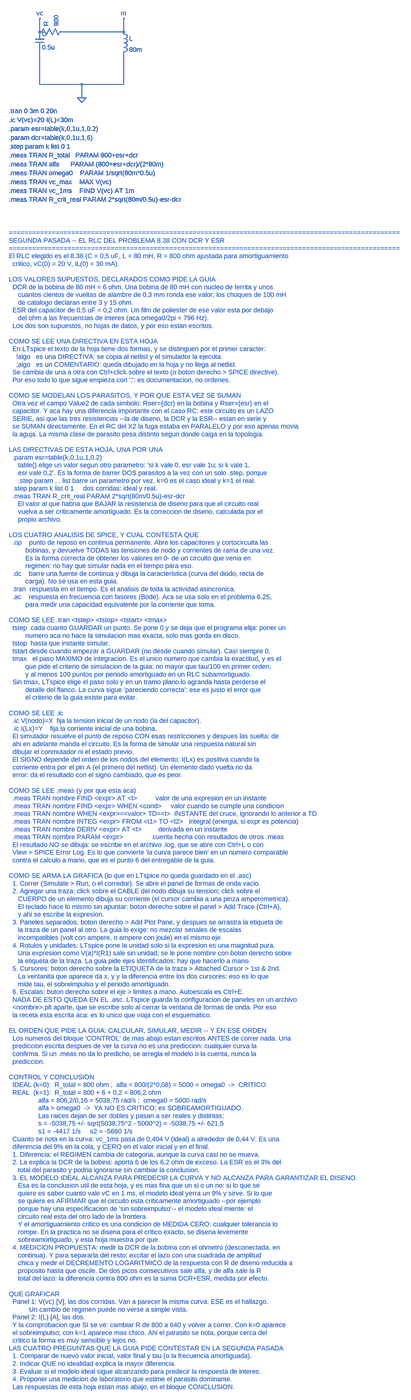
[diagram p0: schematic X3_no_ideal_RLC_con_DCR_ESR.asc, whole sheet]
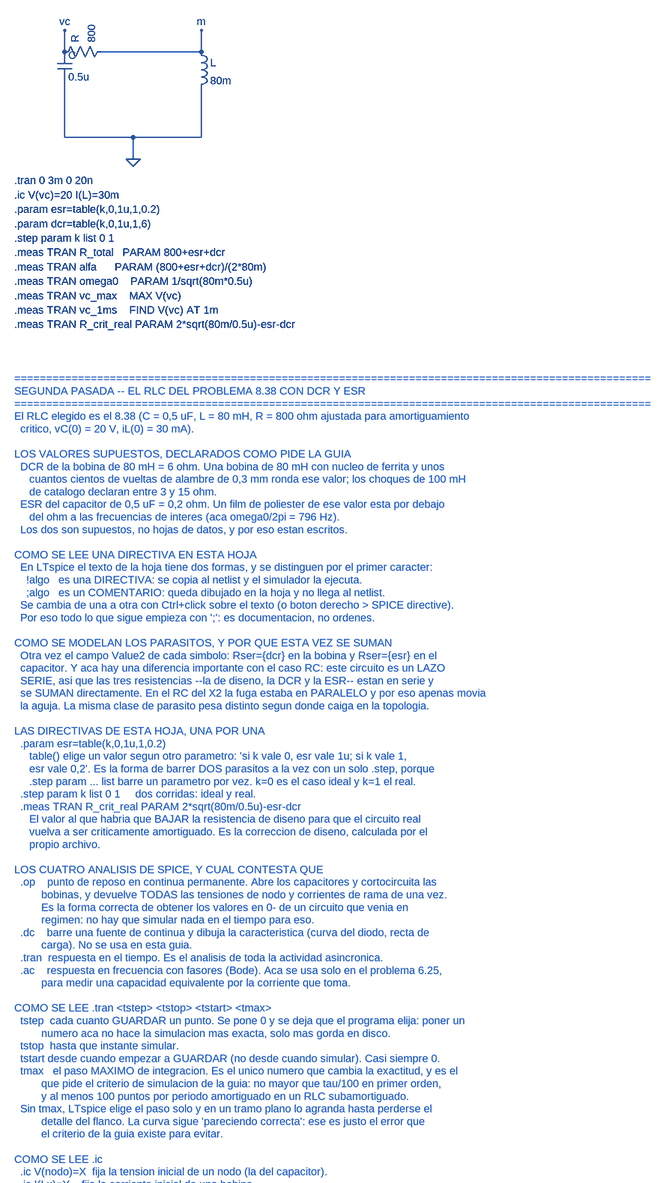
[diagram p1: schematic X3_no_ideal_RLC_con_DCR_ESR.asc, part, row 1 of 2, column 1 of 1]
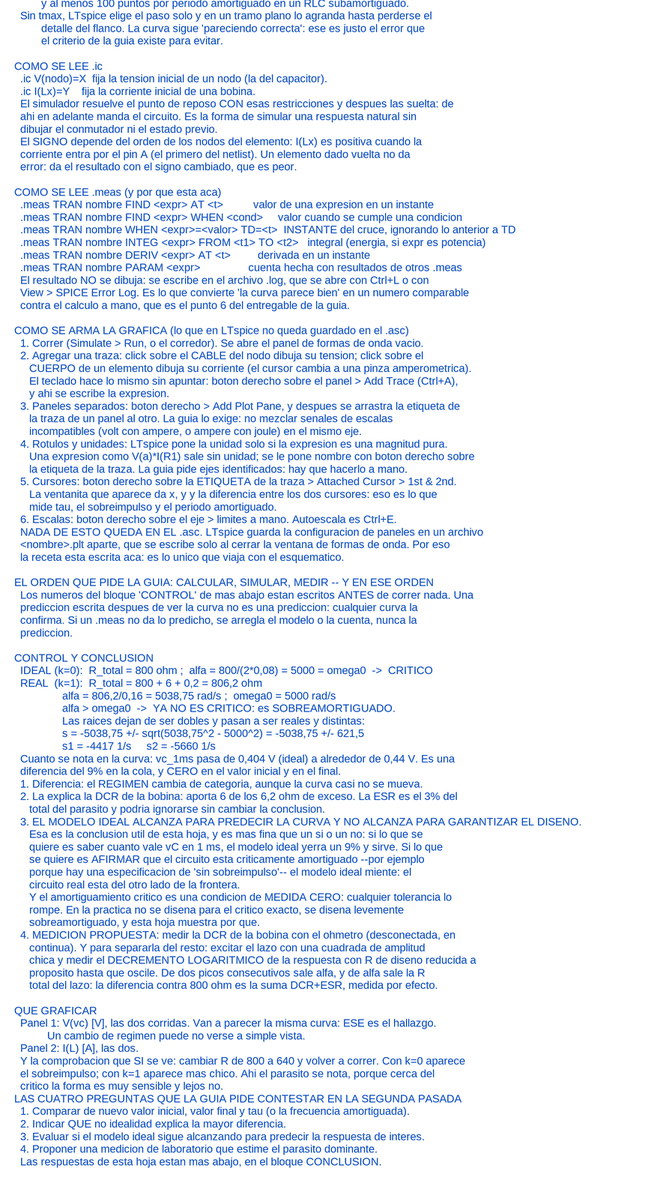
[diagram p2: schematic X3_no_ideal_RLC_con_DCR_ESR.asc, part, row 2 of 2, column 1 of 1]
X3_no_ideal_RLC_con_DCR_ESR.asc, the LTspice schematic file:
Version 4
SHEET 1 2200 2800
WIRE 176 176 176 304
WIRE 256 112 480 112
WIRE 480 192 480 304
WIRE 176 304 480 304
WIRE 328 304 328 352
WIRE 176 112 176 64
WIRE 480 112 480 64
FLAG 328 352 0
FLAG 176 64 vc
FLAG 480 64 m
SYMBOL cap 160 112 R0
SYMATTR InstName C
SYMATTR Value 0.5u
SYMATTR Value2 Rser={esr}
SYMBOL res 160 128 R270
SYMATTR InstName R
SYMATTR Value 800
SYMBOL ind 464 96 R0
SYMATTR InstName L
SYMATTR Value 80m
SYMATTR Value2 Rser={dcr}
TEXT 64 400 Left 2 !.tran 0 3m 0 20n
TEXT 64 432 Left 2 !.ic V(vc)=20 I(L)=30m
TEXT 64 464 Left 2 !.param esr=table(k,0,1u,1,0.2)
TEXT 64 496 Left 2 !.param dcr=table(k,0,1u,1,6)
TEXT 64 528 Left 2 !.step param k list 0 1
TEXT 64 560 Left 2 !.meas TRAN R_total   PARAM 800+esr+dcr
TEXT 64 592 Left 2 !.meas TRAN alfa      PARAM (800+esr+dcr)/(2*80m)
TEXT 64 624 Left 2 !.meas TRAN omega0    PARAM 1/sqrt(80m*0.5u)
TEXT 64 656 Left 2 !.meas TRAN vc_max    MAX V(vc)
TEXT 64 688 Left 2 !.meas TRAN vc_1ms    FIND V(vc) AT 1m
TEXT 64 720 Left 2 !.meas TRAN R_crit_real PARAM 2*sqrt(80m/0.5u)-esr-dcr
TEXT 64 900 Left 2 ;====================================================================================================
TEXT 64 928 Left 2 ;SEGUNDA PASADA -- EL RLC DEL PROBLEMA 8.38 CON DCR Y ESR
TEXT 64 956 Left 2 ;====================================================================================================
TEXT 64 984 Left 2 ;El RLC elegido es el 8.38 (C = 0,5 uF, L = 80 mH, R = 800 ohm ajustada para amortiguamiento
TEXT 64 1012 Left 2 ;  critico, vC(0) = 20 V, iL(0) = 30 mA).
TEXT 64 1040 Left 2 ;
TEXT 64 1068 Left 2 ;LOS VALORES SUPUESTOS, DECLARADOS COMO PIDE LA GUIA
TEXT 64 1096 Left 2 ;  DCR de la bobina de 80 mH = 6 ohm. Una bobina de 80 mH con nucleo de ferrita y unos
TEXT 64 1124 Left 2 ;     cuantos cientos de vueltas de alambre de 0,3 mm ronda ese valor; los choques de 100 mH
TEXT 64 1152 Left 2 ;     de catalogo declaran entre 3 y 15 ohm.
TEXT 64 1180 Left 2 ;  ESR del capacitor de 0,5 uF = 0,2 ohm. Un film de poliester de ese valor esta por debajo
TEXT 64 1208 Left 2 ;     del ohm a las frecuencias de interes (aca omega0/2pi = 796 Hz).
TEXT 64 1236 Left 2 ;  Los dos son supuestos, no hojas de datos, y por eso estan escritos.
TEXT 64 1264 Left 2 ;
TEXT 64 1292 Left 2 ;COMO SE LEE UNA DIRECTIVA EN ESTA HOJA
TEXT 64 1320 Left 2 ;  En LTspice el texto de la hoja tiene dos formas, y se distinguen por el primer caracter:
TEXT 64 1348 Left 2 ;    !algo   es una DIRECTIVA: se copia al netlist y el simulador la ejecuta.
TEXT 64 1376 Left 2 ;    ;algo   es un COMENTARIO: queda dibujado en la hoja y no llega al netlist.
TEXT 64 1404 Left 2 ;  Se cambia de una a otra con Ctrl+click sobre el texto (o boton derecho > SPICE directive).
TEXT 64 1432 Left 2 ;  Por eso todo lo que sigue empieza con ';': es documentacion, no ordenes.
TEXT 64 1460 Left 2 ;
TEXT 64 1488 Left 2 ;COMO SE MODELAN LOS PARASITOS, Y POR QUE ESTA VEZ SE SUMAN
TEXT 64 1516 Left 2 ;  Otra vez el campo Value2 de cada simbolo: Rser={dcr} en la bobina y Rser={esr} en el
TEXT 64 1544 Left 2 ;  capacitor. Y aca hay una diferencia importante con el caso RC: este circuito es un LAZO
TEXT 64 1572 Left 2 ;  SERIE, asi que las tres resistencias --la de diseno, la DCR y la ESR-- estan en serie y
TEXT 64 1600 Left 2 ;  se SUMAN directamente. En el RC del X2 la fuga estaba en PARALELO y por eso apenas movia
TEXT 64 1628 Left 2 ;  la aguja. La misma clase de parasito pesa distinto segun donde caiga en la topologia.
TEXT 64 1656 Left 2 ;
TEXT 64 1684 Left 2 ;LAS DIRECTIVAS DE ESTA HOJA, UNA POR UNA
TEXT 64 1712 Left 2 ;  .param esr=table(k,0,1u,1,0.2)
TEXT 64 1740 Left 2 ;     table() elige un valor segun otro parametro: 'si k vale 0, esr vale 1u; si k vale 1,
TEXT 64 1768 Left 2 ;     esr vale 0,2'. Es la forma de barrer DOS parasitos a la vez con un solo .step, porque
TEXT 64 1796 Left 2 ;     .step param ... list barre un parametro por vez. k=0 es el caso ideal y k=1 el real.
TEXT 64 1824 Left 2 ;  .step param k list 0 1     dos corridas: ideal y real.
TEXT 64 1852 Left 2 ;  .meas TRAN R_crit_real PARAM 2*sqrt(80m/0.5u)-esr-dcr
TEXT 64 1880 Left 2 ;     El valor al que habria que BAJAR la resistencia de diseno para que el circuito real
TEXT 64 1908 Left 2 ;     vuelva a ser criticamente amortiguado. Es la correccion de diseno, calculada por el
TEXT 64 1936 Left 2 ;     propio archivo.
TEXT 64 1964 Left 2 ;
TEXT 64 1992 Left 2 ;LOS CUATRO ANALISIS DE SPICE, Y CUAL CONTESTA QUE
TEXT 64 2020 Left 2 ;  .op    punto de reposo en continua permanente. Abre los capacitores y cortocircuita las
TEXT 64 2048 Left 2 ;         bobinas, y devuelve TODAS las tensiones de nodo y corrientes de rama de una vez.
TEXT 64 2076 Left 2 ;         Es la forma correcta de obtener los valores en 0- de un circuito que venia en
TEXT 64 2104 Left 2 ;         regimen: no hay que simular nada en el tiempo para eso.
TEXT 64 2132 Left 2 ;  .dc    barre una fuente de continua y dibuja la caracteristica (curva del diodo, recta de
TEXT 64 2160 Left 2 ;         carga). No se usa en esta guia.
TEXT 64 2188 Left 2 ;  .tran  respuesta en el tiempo. Es el analisis de toda la actividad asincronica.
TEXT 64 2216 Left 2 ;  .ac    respuesta en frecuencia con fasores (Bode). Aca se usa solo en el problema 6.25,
TEXT 64 2244 Left 2 ;         para medir una capacidad equivalente por la corriente que toma.
TEXT 64 2272 Left 2 ;
TEXT 64 2300 Left 2 ;COMO SE LEE .tran <tstep> <tstop> <tstart> <tmax>
TEXT 64 2328 Left 2 ;  tstep  cada cuanto GUARDAR un punto. Se pone 0 y se deja que el programa elija: poner un
TEXT 64 2356 Left 2 ;         numero aca no hace la simulacion mas exacta, solo mas gorda en disco.
TEXT 64 2384 Left 2 ;  tstop  hasta que instante simular.
TEXT 64 2412 Left 2 ;  tstart desde cuando empezar a GUARDAR (no desde cuando simular). Casi siempre 0.
TEXT 64 2440 Left 2 ;  tmax   el paso MAXIMO de integracion. Es el unico numero que cambia la exactitud, y es el
TEXT 64 2468 Left 2 ;         que pide el criterio de simulacion de la guia: no mayor que tau/100 en primer orden,
TEXT 64 2496 Left 2 ;         y al menos 100 puntos por periodo amortiguado en un RLC subamortiguado.
TEXT 64 2524 Left 2 ;  Sin tmax, LTspice elige el paso solo y en un tramo plano lo agranda hasta perderse el
TEXT 64 2552 Left 2 ;         detalle del flanco. La curva sigue 'pareciendo correcta': ese es justo el error que
TEXT 64 2580 Left 2 ;         el criterio de la guia existe para evitar.
TEXT 64 2608 Left 2 ;
TEXT 64 2636 Left 2 ;COMO SE LEE .ic
TEXT 64 2664 Left 2 ;  .ic V(nodo)=X  fija la tension inicial de un nodo (la del capacitor).
TEXT 64 2692 Left 2 ;  .ic I(Lx)=Y    fija la corriente inicial de una bobina.
TEXT 64 2720 Left 2 ;  El simulador resuelve el punto de reposo CON esas restricciones y despues las suelta: de
TEXT 64 2748 Left 2 ;  ahi en adelante manda el circuito. Es la forma de simular una respuesta natural sin
TEXT 64 2776 Left 2 ;  dibujar el conmutador ni el estado previo.
TEXT 64 2804 Left 2 ;  El SIGNO depende del orden de los nodos del elemento: I(Lx) es positiva cuando la
TEXT 64 2832 Left 2 ;  corriente entra por el pin A (el primero del netlist). Un elemento dado vuelta no da
TEXT 64 2860 Left 2 ;  error: da el resultado con el signo cambiado, que es peor.
TEXT 64 2888 Left 2 ;
TEXT 64 2916 Left 2 ;COMO SE LEE .meas (y por que esta aca)
TEXT 64 2944 Left 2 ;  .meas TRAN nombre FIND <expr> AT <t>          valor de una expresion en un instante
TEXT 64 2972 Left 2 ;  .meas TRAN nombre FIND <expr> WHEN <cond>     valor cuando se cumple una condicion
TEXT 64 3000 Left 2 ;  .meas TRAN nombre WHEN <expr>=<valor> TD=<t>  INSTANTE del cruce, ignorando lo anterior a TD
TEXT 64 3028 Left 2 ;  .meas TRAN nombre INTEG <expr> FROM <t1> TO <t2>   integral (energia, si expr es potencia)
TEXT 64 3056 Left 2 ;  .meas TRAN nombre DERIV <expr> AT <t>         derivada en un instante
TEXT 64 3084 Left 2 ;  .meas TRAN nombre PARAM <expr>                cuenta hecha con resultados de otros .meas
TEXT 64 3112 Left 2 ;  El resultado NO se dibuja: se escribe en el archivo .log, que se abre con Ctrl+L o con
TEXT 64 3140 Left 2 ;  View > SPICE Error Log. Es lo que convierte 'la curva parece bien' en un numero comparable
TEXT 64 3168 Left 2 ;  contra el calculo a mano, que es el punto 6 del entregable de la guia.
TEXT 64 3196 Left 2 ;
TEXT 64 3224 Left 2 ;COMO SE ARMA LA GRAFICA (lo que en LTspice no queda guardado en el .asc)
TEXT 64 3252 Left 2 ;  1. Correr (Simulate > Run, o el corredor). Se abre el panel de formas de onda vacio.
TEXT 64 3280 Left 2 ;  2. Agregar una traza: click sobre el CABLE del nodo dibuja su tension; click sobre el
TEXT 64 3308 Left 2 ;     CUERPO de un elemento dibuja su corriente (el cursor cambia a una pinza amperometrica).
TEXT 64 3336 Left 2 ;     El teclado hace lo mismo sin apuntar: boton derecho sobre el panel > Add Trace (Ctrl+A),
TEXT 64 3364 Left 2 ;     y ahi se escribe la expresion.
TEXT 64 3392 Left 2 ;  3. Paneles separados: boton derecho > Add Plot Pane, y despues se arrastra la etiqueta de
TEXT 64 3420 Left 2 ;     la traza de un panel al otro. La guia lo exige: no mezclar senales de escalas
TEXT 64 3448 Left 2 ;     incompatibles (volt con ampere, o ampere con joule) en el mismo eje.
TEXT 64 3476 Left 2 ;  4. Rotulos y unidades: LTspice pone la unidad solo si la expresion es una magnitud pura.
TEXT 64 3504 Left 2 ;     Una expresion como V(a)*I(R1) sale sin unidad; se le pone nombre con boton derecho sobre
TEXT 64 3532 Left 2 ;     la etiqueta de la traza. La guia pide ejes identificados: hay que hacerlo a mano.
TEXT 64 3560 Left 2 ;  5. Cursores: boton derecho sobre la ETIQUETA de la traza > Attached Cursor > 1st & 2nd.
TEXT 64 3588 Left 2 ;     La ventanita que aparece da x, y y la diferencia entre los dos cursores: eso es lo que
TEXT 64 3616 Left 2 ;     mide tau, el sobreimpulso y el periodo amortiguado.
TEXT 64 3644 Left 2 ;  6. Escalas: boton derecho sobre el eje > limites a mano. Autoescala es Ctrl+E.
TEXT 64 3672 Left 2 ;  NADA DE ESTO QUEDA EN EL .asc. LTspice guarda la configuracion de paneles en un archivo
TEXT 64 3700 Left 2 ;  <nombre>.plt aparte, que se escribe solo al cerrar la ventana de formas de onda. Por eso
TEXT 64 3728 Left 2 ;  la receta esta escrita aca: es lo unico que viaja con el esquematico.
TEXT 64 3756 Left 2 ;
TEXT 64 3784 Left 2 ;EL ORDEN QUE PIDE LA GUIA: CALCULAR, SIMULAR, MEDIR -- Y EN ESE ORDEN
TEXT 64 3812 Left 2 ;  Los numeros del bloque 'CONTROL' de mas abajo estan escritos ANTES de correr nada. Una
TEXT 64 3840 Left 2 ;  prediccion escrita despues de ver la curva no es una prediccion: cualquier curva la
TEXT 64 3868 Left 2 ;  confirma. Si un .meas no da lo predicho, se arregla el modelo o la cuenta, nunca la
TEXT 64 3896 Left 2 ;  prediccion.
TEXT 64 3924 Left 2 ;
TEXT 64 3952 Left 2 ;CONTROL Y CONCLUSION
TEXT 64 3980 Left 2 ;  IDEAL (k=0):  R_total = 800 ohm ;  alfa = 800/(2*0,08) = 5000 = omega0  ->  CRITICO
TEXT 64 4008 Left 2 ;  REAL  (k=1):  R_total = 800 + 6 + 0,2 = 806,2 ohm
TEXT 64 4036 Left 2 ;                alfa = 806,2/0,16 = 5038,75 rad/s ;  omega0 = 5000 rad/s
TEXT 64 4064 Left 2 ;                alfa > omega0  ->  YA NO ES CRITICO: es SOBREAMORTIGUADO.
TEXT 64 4092 Left 2 ;                Las raices dejan de ser dobles y pasan a ser reales y distintas:
TEXT 64 4120 Left 2 ;                s = -5038,75 +/- sqrt(5038,75^2 - 5000^2) = -5038,75 +/- 621,5
TEXT 64 4148 Left 2 ;                s1 = -4417 1/s     s2 = -5660 1/s
TEXT 64 4176 Left 2 ;  Cuanto se nota en la curva: vc_1ms pasa de 0,404 V (ideal) a alrededor de 0,44 V. Es una
TEXT 64 4204 Left 2 ;  diferencia del 9% en la cola, y CERO en el valor inicial y en el final.
TEXT 64 4232 Left 2 ;  1. Diferencia: el REGIMEN cambia de categoria, aunque la curva casi no se mueva.
TEXT 64 4260 Left 2 ;  2. La explica la DCR de la bobina: aporta 6 de los 6,2 ohm de exceso. La ESR es el 3% del
TEXT 64 4288 Left 2 ;     total del parasito y podria ignorarse sin cambiar la conclusion.
TEXT 64 4316 Left 2 ;  3. EL MODELO IDEAL ALCANZA PARA PREDECIR LA CURVA Y NO ALCANZA PARA GARANTIZAR EL DISENO.
TEXT 64 4344 Left 2 ;     Esa es la conclusion util de esta hoja, y es mas fina que un si o un no: si lo que se
TEXT 64 4372 Left 2 ;     quiere es saber cuanto vale vC en 1 ms, el modelo ideal yerra un 9% y sirve. Si lo que
TEXT 64 4400 Left 2 ;     se quiere es AFIRMAR que el circuito esta criticamente amortiguado --por ejemplo
TEXT 64 4428 Left 2 ;     porque hay una especificacion de 'sin sobreimpulso'-- el modelo ideal miente: el
TEXT 64 4456 Left 2 ;     circuito real esta del otro lado de la frontera.
TEXT 64 4484 Left 2 ;     Y el amortiguamiento critico es una condicion de MEDIDA CERO: cualquier tolerancia lo
TEXT 64 4512 Left 2 ;     rompe. En la practica no se disena para el critico exacto, se disena levemente
TEXT 64 4540 Left 2 ;     sobreamortiguado, y esta hoja muestra por que.
TEXT 64 4568 Left 2 ;  4. MEDICION PROPUESTA: medir la DCR de la bobina con el ohmetro (desconectada, en
TEXT 64 4596 Left 2 ;     continua). Y para separarla del resto: excitar el lazo con una cuadrada de amplitud
TEXT 64 4624 Left 2 ;     chica y medir el DECREMENTO LOGARITMICO de la respuesta con R de diseno reducida a
TEXT 64 4652 Left 2 ;     proposito hasta que oscile. De dos picos consecutivos sale alfa, y de alfa sale la R
TEXT 64 4680 Left 2 ;     total del lazo: la diferencia contra 800 ohm es la suma DCR+ESR, medida por efecto.
TEXT 64 4708 Left 2 ;
TEXT 64 4736 Left 2 ;QUE GRAFICAR
TEXT 64 4764 Left 2 ;  Panel 1: V(vc) [V], las dos corridas. Van a parecer la misma curva: ESE es el hallazgo.
TEXT 64 4792 Left 2 ;           Un cambio de regimen puede no verse a simple vista.
TEXT 64 4820 Left 2 ;  Panel 2: I(L) [A], las dos.
TEXT 64 4848 Left 2 ;  Y la comprobacion que SI se ve: cambiar R de 800 a 640 y volver a correr. Con k=0 aparece
TEXT 64 4876 Left 2 ;  el sobreimpulso; con k=1 aparece mas chico. Ahi el parasito se nota, porque cerca del
TEXT 64 4904 Left 2 ;  critico la forma es muy sensible y lejos no.
TEXT 64 4932 Left 2 ;LAS CUATRO PREGUNTAS QUE LA GUIA PIDE CONTESTAR EN LA SEGUNDA PASADA
TEXT 64 4960 Left 2 ;  1. Comparar de nuevo valor inicial, valor final y tau (o la frecuencia amortiguada).
TEXT 64 4988 Left 2 ;  2. Indicar QUE no idealidad explica la mayor diferencia.
TEXT 64 5016 Left 2 ;  3. Evaluar si el modelo ideal sigue alcanzando para predecir la respuesta de interes.
TEXT 64 5044 Left 2 ;  4. Proponer una medicion de laboratorio que estime el parasito dominante.
TEXT 64 5072 Left 2 ;  Las respuestas de esta hoja estan mas abajo, en el bloque CONCLUSION.

The netlist it stands for:
* X3_no_ideal_RLC_con_DCR_ESR.asc
C vc 0 0.5u Rser={esr}
R vc m 800
L m 0 80m Rser={dcr}
.tran 0 3m 0 20n
.ic V(vc)=20 I(L)=30m
.param esr=table(k,0,1u,1,0.2)
.param dcr=table(k,0,1u,1,6)
.step param k list 0 1
.meas TRAN R_total   PARAM 800+esr+dcr
.meas TRAN alfa      PARAM (800+esr+dcr)/(2*80m)
.meas TRAN omega0    PARAM 1/sqrt(80m*0.5u)
.meas TRAN vc_max    MAX V(vc)
.meas TRAN vc_1ms    FIND V(vc) AT 1m
.meas TRAN R_crit_real PARAM 2*sqrt(80m/0.5u)-esr-dcr
* ====================================================================================================
* SEGUNDA PASADA -- EL RLC DEL PROBLEMA 8.38 CON DCR Y ESR
* ====================================================================================================
* El RLC elegido es el 8.38 (C = 0,5 uF, L = 80 mH, R = 800 ohm ajustada para amortiguamiento
*   critico, vC(0) = 20 V, iL(0) = 30 mA).
* LOS VALORES SUPUESTOS, DECLARADOS COMO PIDE LA GUIA
*   DCR de la bobina de 80 mH = 6 ohm. Una bobina de 80 mH con nucleo de ferrita y unos
*      cuantos cientos de vueltas de alambre de 0,3 mm ronda ese valor; los choques de 100 mH
*      de catalogo declaran entre 3 y 15 ohm.
*   ESR del capacitor de 0,5 uF = 0,2 ohm. Un film de poliester de ese valor esta por debajo
*      del ohm a las frecuencias de interes (aca omega0/2pi = 796 Hz).
*   Los dos son supuestos, no hojas de datos, y por eso estan escritos.
* COMO SE LEE UNA DIRECTIVA EN ESTA HOJA
*   En LTspice el texto de la hoja tiene dos formas, y se distinguen por el primer caracter:
*     !algo   es una DIRECTIVA: se copia al netlist y el simulador la ejecuta.
*     ;algo   es un COMENTARIO: queda dibujado en la hoja y no llega al netlist.
*   Se cambia de una a otra con Ctrl+click sobre el texto (o boton derecho > SPICE directive).
*   Por eso todo lo que sigue empieza con ';': es documentacion, no ordenes.
* COMO SE MODELAN LOS PARASITOS, Y POR QUE ESTA VEZ SE SUMAN
*   Otra vez el campo Value2 de cada simbolo: Rser={dcr} en la bobina y Rser={esr} en el
*   capacitor. Y aca hay una diferencia importante con el caso RC: este circuito es un LAZO
*   SERIE, asi que las tres resistencias --la de diseno, la DCR y la ESR-- estan en serie y
*   se SUMAN directamente. En el RC del X2 la fuga estaba en PARALELO y por eso apenas movia
*   la aguja. La misma clase de parasito pesa distinto segun donde caiga en la topologia.
* LAS DIRECTIVAS DE ESTA HOJA, UNA POR UNA
*   .param esr=table(k,0,1u,1,0.2)
*      table() elige un valor segun otro parametro: 'si k vale 0, esr vale 1u; si k vale 1,
*      esr vale 0,2'. Es la forma de barrer DOS parasitos a la vez con un solo .step, porque
*      .step param ... list barre un parametro por vez. k=0 es el caso ideal y k=1 el real.
*   .step param k list 0 1     dos corridas: ideal y real.
*   .meas TRAN R_crit_real PARAM 2*sqrt(80m/0.5u)-esr-dcr
*      El valor al que habria que BAJAR la resistencia de diseno para que el circuito real
*      vuelva a ser criticamente amortiguado. Es la correccion de diseno, calculada por el
*      propio archivo.
* LOS CUATRO ANALISIS DE SPICE, Y CUAL CONTESTA QUE
*   .op    punto de reposo en continua permanente. Abre los capacitores y cortocircuita las
*          bobinas, y devuelve TODAS las tensiones de nodo y corrientes de rama de una vez.
*          Es la forma correcta de obtener los valores en 0- de un circuito que venia en
*          regimen: no hay que simular nada en el tiempo para eso.
*   .dc    barre una fuente de continua y dibuja la caracteristica (curva del diodo, recta de
*          carga). No se usa en esta guia.
*   .tran  respuesta en el tiempo. Es el analisis de toda la actividad asincronica.
*   .ac    respuesta en frecuencia con fasores (Bode). Aca se usa solo en el problema 6.25,
*          para medir una capacidad equivalente por la corriente que toma.
* COMO SE LEE .tran <tstep> <tstop> <tstart> <tmax>
*   tstep  cada cuanto GUARDAR un punto. Se pone 0 y se deja que el programa elija: poner un
*          numero aca no hace la simulacion mas exacta, solo mas gorda en disco.
*   tstop  hasta que instante simular.
*   tstart desde cuando empezar a GUARDAR (no desde cuando simular). Casi siempre 0.
*   tmax   el paso MAXIMO de integracion. Es el unico numero que cambia la exactitud, y es el
*          que pide el criterio de simulacion de la guia: no mayor que tau/100 en primer orden,
*          y al menos 100 puntos por periodo amortiguado en un RLC subamortiguado.
*   Sin tmax, LTspice elige el paso solo y en un tramo plano lo agranda hasta perderse el
*          detalle del flanco. La curva sigue 'pareciendo correcta': ese es justo el error que
*          el criterio de la guia existe para evitar.
* COMO SE LEE .ic
*   .ic V(nodo)=X  fija la tension inicial de un nodo (la del capacitor).
*   .ic I(Lx)=Y    fija la corriente inicial de una bobina.
*   El simulador resuelve el punto de reposo CON esas restricciones y despues las suelta: de
*   ahi en adelante manda el circuito. Es la forma de simular una respuesta natural sin
*   dibujar el conmutador ni el estado previo.
*   El SIGNO depende del orden de los nodos del elemento: I(Lx) es positiva cuando la
*   corriente entra por el pin A (el primero del netlist). Un elemento dado vuelta no da
*   error: da el resultado con el signo cambiado, que es peor.
* COMO SE LEE .meas (y por que esta aca)
*   .meas TRAN nombre FIND <expr> AT <t>          valor de una expresion en un instante
*   .meas TRAN nombre FIND <expr> WHEN <cond>     valor cuando se cumple una condicion
*   .meas TRAN nombre WHEN <expr>=<valor> TD=<t>  INSTANTE del cruce, ignorando lo anterior a TD
*   .meas TRAN nombre INTEG <expr> FROM <t1> TO <t2>   integral (energia, si expr es potencia)
*   .meas TRAN nombre DERIV <expr> AT <t>         derivada en un instante
*   .meas TRAN nombre PARAM <expr>                cuenta hecha con resultados de otros .meas
*   El resultado NO se dibuja: se escribe en el archivo .log, que se abre con Ctrl+L o con
*   View > SPICE Error Log. Es lo que convierte 'la curva parece bien' en un numero comparable
*   contra el calculo a mano, que es el punto 6 del entregable de la guia.
* COMO SE ARMA LA GRAFICA (lo que en LTspice no queda guardado en el .asc)
*   1. Correr (Simulate > Run, o el corredor). Se abre el panel de formas de onda vacio.
*   2. Agregar una traza: click sobre el CABLE del nodo dibuja su tension; click sobre el
*      CUERPO de un elemento dibuja su corriente (el cursor cambia a una pinza amperometrica).
*      El teclado hace lo mismo sin apuntar: boton derecho sobre el panel > Add Trace (Ctrl+A),
*      y ahi se escribe la expresion.
*   3. Paneles separados: boton derecho > Add Plot Pane, y despues se arrastra la etiqueta de
*      la traza de un panel al otro. La guia lo exige: no mezclar senales de escalas
*      incompatibles (volt con ampere, o ampere con joule) en el mismo eje.
*   4. Rotulos y unidades: LTspice pone la unidad solo si la expresion es una magnitud pura.
*      Una expresion como V(a)*I(R1) sale sin unidad; se le pone nombre con boton derecho sobre
*      la etiqueta de la traza. La guia pide ejes identificados: hay que hacerlo a mano.
*   5. Cursores: boton derecho sobre la ETIQUETA de la traza > Attached Cursor > 1st & 2nd.
*      La ventanita que aparece da x, y y la diferencia entre los dos cursores: eso es lo que
*      mide tau, el sobreimpulso y el periodo amortiguado.
*   6. Escalas: boton derecho sobre el eje > limites a mano. Autoescala es Ctrl+E.
*   NADA DE ESTO QUEDA EN EL .asc. LTspice guarda la configuracion de paneles en un archivo
*   <nombre>.plt aparte, que se escribe solo al cerrar la ventana de formas de onda. Por eso
*   la receta esta escrita aca: es lo unico que viaja con el esquematico.
* EL ORDEN QUE PIDE LA GUIA: CALCULAR, SIMULAR, MEDIR -- Y EN ESE ORDEN
*   Los numeros del bloque 'CONTROL' de mas abajo estan escritos ANTES de correr nada. Una
*   prediccion escrita despues de ver la curva no es una prediccion: cualquier curva la
*   confirma. Si un .meas no da lo predicho, se arregla el modelo o la cuenta, nunca la
*   prediccion.
* CONTROL Y CONCLUSION
*   IDEAL (k=0):  R_total = 800 ohm ;  alfa = 800/(2*0,08) = 5000 = omega0  ->  CRITICO
*   REAL  (k=1):  R_total = 800 + 6 + 0,2 = 806,2 ohm
*                 alfa = 806,2/0,16 = 5038,75 rad/s ;  omega0 = 5000 rad/s
*                 alfa > omega0  ->  YA NO ES CRITICO: es SOBREAMORTIGUADO.
*                 Las raices dejan de ser dobles y pasan a ser reales y distintas:
*                 s = -5038,75 +/- sqrt(5038,75^2 - 5000^2) = -5038,75 +/- 621,5
*                 s1 = -4417 1/s     s2 = -5660 1/s
*   Cuanto se nota en la curva: vc_1ms pasa de 0,404 V (ideal) a alrededor de 0,44 V. Es una
*   diferencia del 9% en la cola, y CERO en el valor inicial y en el final.
*   1. Diferencia: el REGIMEN cambia de categoria, aunque la curva casi no se mueva.
*   2. La explica la DCR de la bobina: aporta 6 de los 6,2 ohm de exceso. La ESR es el 3% del
*      total del parasito y podria ignorarse sin cambiar la conclusion.
*   3. EL MODELO IDEAL ALCANZA PARA PREDECIR LA CURVA Y NO ALCANZA PARA GARANTIZAR EL DISENO.
*      Esa es la conclusion util de esta hoja, y es mas fina que un si o un no: si lo que se
*      quiere es saber cuanto vale vC en 1 ms, el modelo ideal yerra un 9% y sirve. Si lo que
*      se quiere es AFIRMAR que el circuito esta criticamente amortiguado --por ejemplo
*      porque hay una especificacion de 'sin sobreimpulso'-- el modelo ideal miente: el
*      circuito real esta del otro lado de la frontera.
*      Y el amortiguamiento critico es una condicion de MEDIDA CERO: cualquier tolerancia lo
*      rompe. En la practica no se disena para el critico exacto, se disena levemente
*      sobreamortiguado, y esta hoja muestra por que.
*   4. MEDICION PROPUESTA: medir la DCR de la bobina con el ohmetro (desconectada, en
*      continua). Y para separarla del resto: excitar el lazo con una cuadrada de amplitud
*      chica y medir el DECREMENTO LOGARITMICO de la respuesta con R de diseno reducida a
*      proposito hasta que oscile. De dos picos consecutivos sale alfa, y de alfa sale la R
*      total del lazo: la diferencia contra 800 ohm es la suma DCR+ESR, medida por efecto.
* QUE GRAFICAR
*   Panel 1: V(vc) [V], las dos corridas. Van a parecer la misma curva: ESE es el hallazgo.
*            Un cambio de regimen puede no verse a simple vista.
*   Panel 2: I(L) [A], las dos.
*   Y la comprobacion que SI se ve: cambiar R de 800 a 640 y volver a correr. Con k=0 aparece
*   el sobreimpulso; con k=1 aparece mas chico. Ahi el parasito se nota, porque cerca del
*   critico la forma es muy sensible y lejos no.
* LAS CUATRO PREGUNTAS QUE LA GUIA PIDE CONTESTAR EN LA SEGUNDA PASADA
*   1. Comparar de nuevo valor inicial, valor final y tau (o la frecuencia amortiguada).
*   2. Indicar QUE no idealidad explica la mayor diferencia.
*   3. Evaluar si el modelo ideal sigue alcanzando para predecir la respuesta de interes.
*   4. Proponer una medicion de laboratorio que estime el parasito dominante.
*   Las respuestas de esta hoja estan mas abajo, en el bloque CONCLUSION.
.backanno
.end